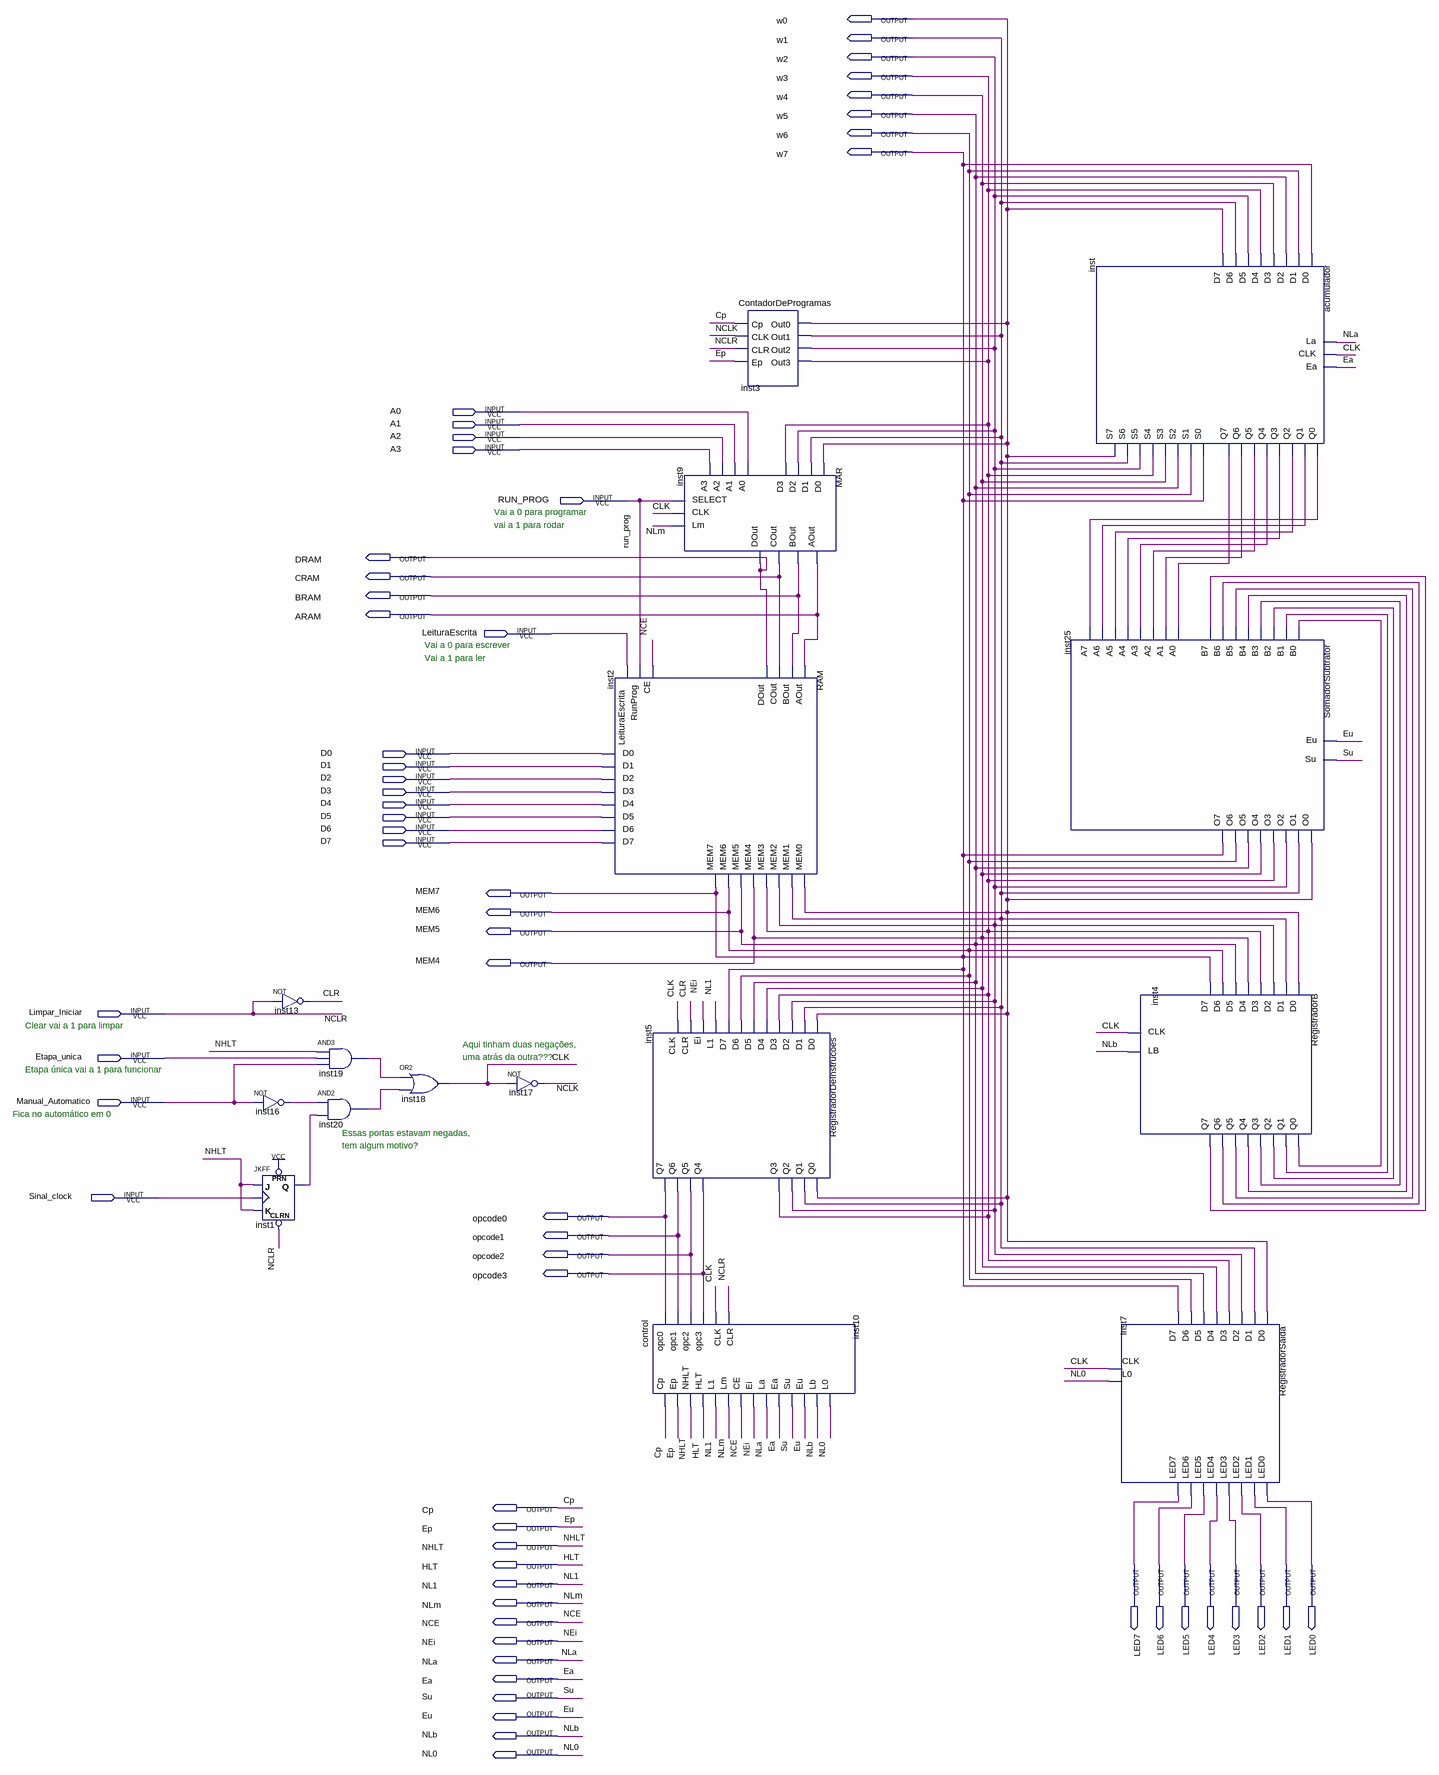
[diagram p0: schematic sheet]
// Quartus schematic SAP1.bdf as structural Verilog: 16 symbols, 60 pins
module SAP1 (
  input  A0,
  input  A1,
  input  A2,
  input  A3,
  input  RUN_PROG,
  input  LeituraEscrita,
  input  D0,
  input  D1,
  input  D2,
  input  D3,
  input  D4,
  input  D5,
  input  D6,
  input  D7,
  input  Limpar_Iniciar,
  input  Etapa_unica,
  input  Manual_Automatico,
  input  Sinal_clock,
  output w0,
  output w1,
  output w2,
  output w3,
  output w4,
  output w5,
  output w6,
  output w7,
  output DRAM,
  output CRAM,
  output BRAM,
  output ARAM,
  output MEM7,
  output MEM6,
  output MEM5,
  output MEM4,
  output opcode0,
  output opcode1,
  output opcode2,
  output opcode3,
  output Cp,
  output Ep,
  output NHLT,
  output HLT,
  output LED7,
  output LED6,
  output LED5,
  output LED4,
  output LED3,
  output LED2,
  output LED1,
  output LED0,
  output NL1,
  output NLm,
  output NCE,
  output NEi,
  output NLa,
  output Ea,
  output Su,
  output Eu,
  output NLb,
  output NL0
);

  wire CLK, CLR, inst1_q, inst4_q0, inst4_q1, inst4_q2, inst4_q3, inst4_q4, inst4_q5, inst4_q6, inst4_q7,
       inst16_out, inst19_out, inst20_out, inst_q0, inst_q1, inst_q2, inst_q3, inst_q4, inst_q5, inst_q6,
       inst_q7, NCLK;

  not inst13 (CLR, Limpar_Iniciar);
  not inst16 (inst16_out, Manual_Automatico);
  JKFF inst1 (.PRN(1'b1), .CLRN(Limpar_Iniciar), .K(NHLT), .J(NHLT), .CLK(Sinal_clock), .Q(inst1_q));
  and inst19 (inst19_out, NHLT, Etapa_unica, Manual_Automatico);
  and inst20 (inst20_out, inst16_out, inst1_q);
  or inst18 (CLK, inst19_out, inst20_out);
  not inst17 (NCLK, CLK);
  RAM inst2 (
    .AOut(ARAM), .BOut(BRAM), .COut(CRAM), .DOut(DRAM), .D3(D3), .D7(D7), .D2(D2), .D6(D6), .D1(D1), .D5(D5),
    .D0(D0), .D4(D4), .CE(NCE), .RunProg(RUN_PROG), .LeituraEscrita(LeituraEscrita), .MEM0(w0), .MEM4(MEM4),
    .MEM1(w1), .MEM5(MEM5), .MEM2(w2), .MEM6(MEM6), .MEM3(w3), .MEM7(MEM7));
  RegistradorDeInstrucoes inst5 (
    .D0(w0), .D1(w1), .D2(w2), .D3(w3), .D4(MEM4), .D5(MEM5), .D6(MEM6), .D7(MEM7), .L1(NL1), .Ei(NEi),
    .CLR(CLR), .CLK(CLK), .Q0(w0), .Q1(w1), .Q2(w2), .Q3(w3), .Q4(opcode3), .Q5(opcode2), .Q6(opcode1),
    .Q7(opcode0));
  control inst10 (
    .opc3(opcode3), .opc2(opcode2), .opc1(opcode1), .opc0(opcode0), .CLK(CLK), .CLR(Limpar_Iniciar), .Cp(Cp),
    .Ep(Ep), .NHLT(NHLT), .HLT(HLT), .L1(NL1), .Lm(NLm), .CE(NCE), .Ei(NEi), .La(NLa), .Ea(Ea), .Su(Su),
    .Eu(Eu), .Lb(NLb), .L0(NL0));
  MAR inst9 (
    .D0(w0), .D1(w1), .D2(w2), .D3(w3), .Lm(NLm), .CLK(CLK), .A0(A0), .A1(A1), .A2(A2), .A3(A3),
    .SELECT(RUN_PROG), .AOut(ARAM), .COut(CRAM), .BOut(BRAM), .DOut(DRAM));
  ContadorDeProgramas inst3 (
    .Cp(Cp), .CLK(NCLK), .CLR(Limpar_Iniciar), .Ep(Ep), .Out0(w0), .Out1(w1), .Out2(w2), .Out3(w3));
  SomadorSubtrator inst25 (
    .A0(inst_q7), .A1(inst_q6), .A2(inst_q5), .A3(inst_q4), .B0(inst4_q0), .B1(inst4_q1), .B2(inst4_q2),
    .B3(inst4_q3), .B4(inst4_q4), .B5(inst4_q5), .B6(inst4_q6), .B7(inst4_q7), .A4(inst_q3), .A5(inst_q2),
    .A6(inst_q1), .A7(inst_q0), .Su(Su), .Eu(Eu), .O0(w0), .O1(w1), .O2(w2), .O3(w3), .O4(MEM4), .O5(MEM5),
    .O6(MEM6), .O7(MEM7));
  acumulador inst (
    .D0(MEM7), .D1(MEM6), .D2(MEM5), .D3(MEM4), .D4(w3), .D5(w2), .D6(w1), .D7(w0), .La(NLa), .CLK(CLK),
    .Ea(Ea), .Q0(inst_q0), .Q1(inst_q1), .Q2(inst_q2), .Q3(inst_q3), .Q4(inst_q4), .Q5(inst_q5),
    .Q6(inst_q6), .Q7(inst_q7), .S0(MEM7), .S1(MEM6), .S2(MEM5), .S3(MEM4), .S4(w3), .S5(w2), .S6(w1), .S7(w0));
  RegistradorSaida inst7 (
    .D0(w0), .D1(w1), .D2(w2), .D3(w3), .D4(MEM4), .D5(MEM5), .D6(MEM6), .D7(MEM7), .L0(NL0), .CLK(CLK),
    .LED0(LED0), .LED1(LED1), .LED2(LED2), .LED3(LED3), .LED4(LED4), .LED5(LED5), .LED6(LED6), .LED7(LED7));
  RegistradorB inst4 (
    .D0(w0), .D1(w1), .D2(w2), .D3(w3), .D4(MEM4), .D5(MEM5), .D6(MEM6), .D7(MEM7), .LB(NLb), .CLK(CLK),
    .Q0(inst4_q0), .Q1(inst4_q1), .Q2(inst4_q2), .Q3(inst4_q3), .Q4(inst4_q4), .Q5(inst4_q5), .Q6(inst4_q6),
    .Q7(inst4_q7));

  assign w4 = MEM4;
  assign w5 = MEM5;
  assign w6 = MEM6;
  assign w7 = MEM7;

  // Other names for the same wires on the sheet: NCLR = Limpar_Iniciar

  // Notes on the sheet:
  //   Vai a 0 para programar
  //   vai a 1 para rodar
  //   Vai a 0 para escrever
  //   Vai a 1 para ler
  //   Clear vai a 1 para limpar
  //   Aqui tinham duas negações, 
  //   uma atrás da outra???
  //   Etapa única vai a 1 para funcionar 
  //   Fica no automático em 0
  //   Essas portas estavam negadas, 
  //   tem algum motivo?
endmodule
